# EAGLE schematic LD12 (EAGLE 6.6.0)
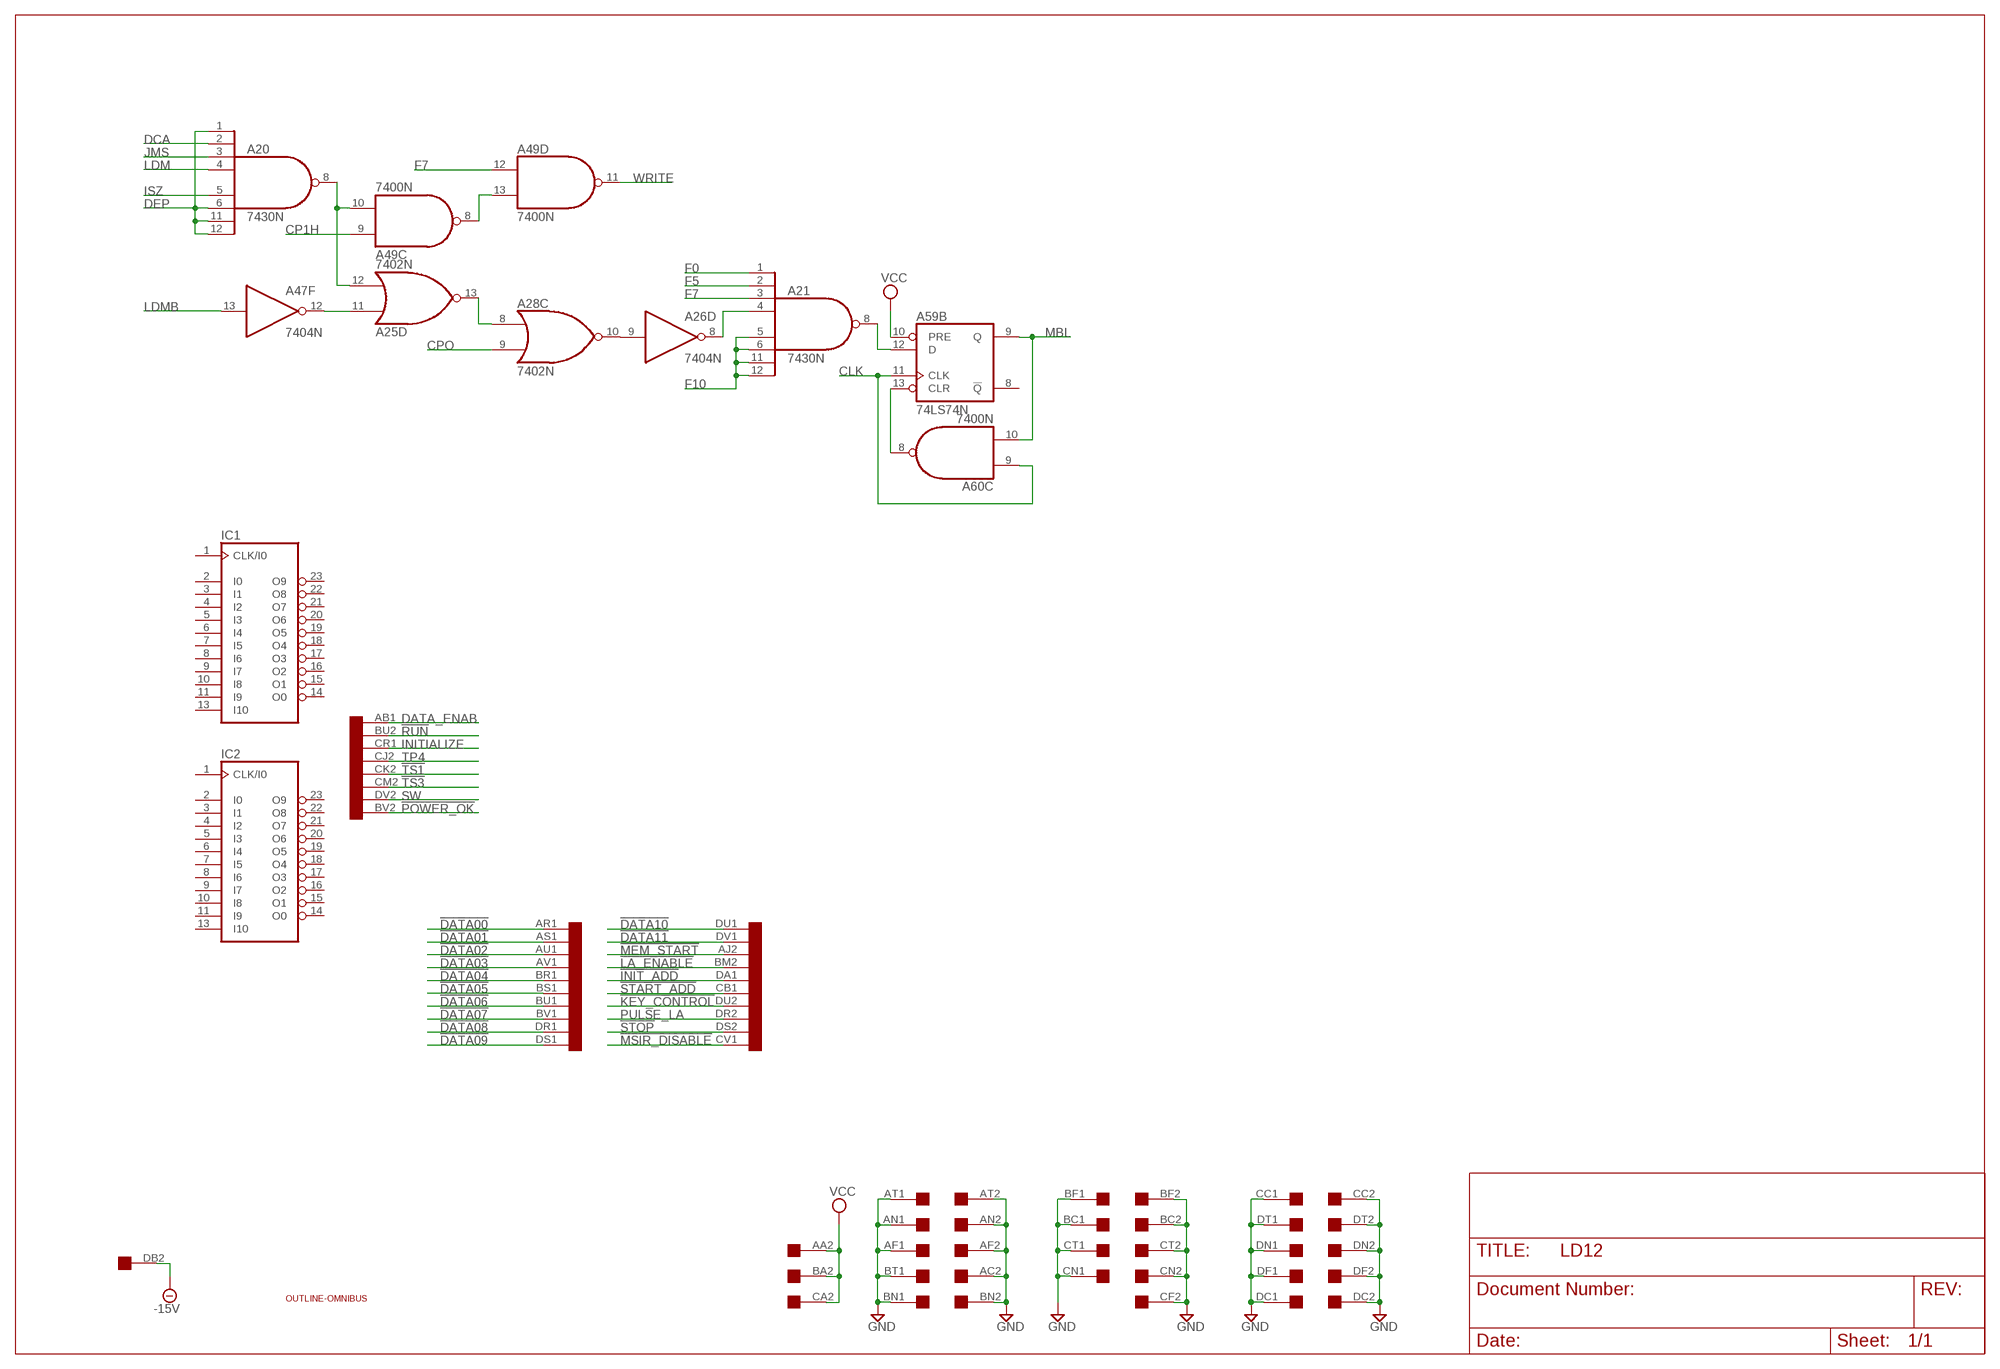
[diagram p0: schematic, sheet 1]

## Parts
A20  7430N  [DIL14]
A21  7430N  [DIL14]
A25  7402N  [DIL14]
A26  7404N  [DIL14]
A28  7402N  [DIL14]
A47  7404N  [DIL14]
A49  7400N  [DIL14]
A59  74LS74N  [DIL14]
A60  7400N  [DIL14]
IC1  22V10  [DIL24-3]
IC2  22V10  [DIL24-3]
U$1  OUTLINE-OMNIBUS  [OMNIBUS]
U$2  QUAD  [EDGE-CON8]

## Nets
!DATA00: U$2.AR1
!DATA01: U$2.AS1
!DATA02: U$2.AU1
!DATA03: U$2.AV1
!DATA04: U$2.BR1
!DATA05: U$2.BS1
!DATA06: U$2.BU1
!DATA07: U$2.BV1
!DATA08: U$2.DR1
!DATA09: U$2.DS1
!DATA10: U$2.DU1
!DATA11: U$2.DV1
!INIT_ADD: U$2.DA1
!KEY_CONTROL: U$2.DU2
!LA_ENABLE: U$2.BM2
!MEM_START: U$2.AJ2
!MSIR_DISABLE: U$2.CV1
!POWER_OK: U$2.BV2
!RUN: U$2.BU2
!START_ADD: U$2.CB1
!STOP: U$2.DS2
!TS1: U$2.CK2
!TS3: U$2.CM2
-15V [supply]: U$2.DB2
CLK: A59.11(B:CLK) A60.9(C:I0)
CP1H: A49.9(C:I0)
CPO: A28.9(C:I1)
DATA_ENAB: U$2.AB1
DCA: A20.2(I1)
DEP: A20.1(I0) A20.6(I5) A20.11(I6) A20.12(I7)
F0: A21.1(I0)
F5: A21.2(I1)
F7: A21.3(I2) A49.12(D:I0)
F10: A21.5(I4) A21.6(I5) A21.11(I6) A21.12(I7)
GND [supply]: U$2.AC2 U$2.AF1 U$2.AF2 U$2.AN1 U$2.AN2 U$2.AT1 U$2.AT2 U$2.BC1 U$2.BC2 U$2.BF1 U$2.BF2 U$2.BN1 U$2.BN2 U$2.BT1 U$2.CC1 U$2.CC2 U$2.CF2 U$2.CN1 U$2.CN2 U$2.CT1 U$2.CT2 U$2.DC1 U$2.DC2 U$2.DF1 U$2.DF2 U$2.DN1 U$2.DN2 U$2.DT1 U$2.DT2
INITIALIZE: U$2.CR1
ISZ: A20.5(I4)
JMS: A20.3(I2)
LDM: A20.4(I3)
LDMB: A47.13(F:I)
MBL: A59.9(B:Q) A60.10(C:I1)
N$1: A20.8(O) A25.12(D:I1) A49.10(C:I1)
N$2: A25.11(D:I0) A47.12(F:O)
N$3: A49.8(C:O) A49.13(D:I1)
N$4: A25.13(D:O) A28.8(C:I0)
N$5: A26.9(D:I) A28.10(C:O)
N$6: A21.4(I3) A26.8(D:O)
N$7: A21.8(O) A59.12(B:D)
N$8: A59.13(B:CLR) A60.8(C:O)
PULSE_LA: U$2.DR2
SW: U$2.DV2
TP4: U$2.CJ2
VCC: A59.10(B:PRE) U$2.AA2 U$2.BA2 U$2.CA2
WRITE: A49.11(D:O)
Unconnected: A25.1(A:O) A25.2(A:I0) A25.3(A:I1) A25.4(B:O) A25.5(B:I0) A25.6(B:I1) A25.8(C:I0) A25.9(C:I1) A25.10(C:O) A26.1(A:I) A26.2(A:O) A26.3(B:I) A26.4(B:O) A26.5(C:I) A26.6(C:O) A26.10(E:O) A26.11(E:I) A26.12(F:O) A26.13(F:I) A28.1(A:O) A28.2(A:I0) A28.3(A:I1) A28.4(B:O) A28.5(B:I0) A28.6(B:I1) A28.11(D:I0) A28.12(D:I1) A28.13(D:O) A47.1(A:I) A47.2(A:O) A47.3(B:I) A47.4(B:O) A47.5(C:I) A47.6(C:O) A47.8(D:O) A47.9(D:I) A47.10(E:O) A47.11(E:I) A49.1(A:I0) A49.2(A:I1) A49.3(A:O) A49.4(B:I0) A49.5(B:I1) A49.6(B:O) A59.1(A:CLR) A59.2(A:D) A59.3(A:CLK) A59.4(A:PRE) A59.5(A:Q) A59.6(A:!Q) A59.8(B:!Q) A60.1(A:I0) A60.2(A:I1) A60.3(A:O) A60.4(B:I0) A60.5(B:I1) A60.6(B:O) A60.11(D:O) A60.12(D:I0) A60.13(D:I1) IC1.1(CLK/I0) IC1.2(I0) IC1.3(I1) IC1.4(I2) IC1.5(I3) IC1.6(I4) IC1.7(I5) IC1.8(I6) IC1.9(I7) IC1.10(I8) IC1.11(I9) IC1.13(I10) IC1.14(O0) IC1.15(O1) IC1.16(O2) IC1.17(O3) IC1.18(O4) IC1.19(O5) IC1.20(O6) IC1.21(O7) IC1.22(O8) IC1.23(O9) IC2.1(CLK/I0) IC2.2(I0) IC2.3(I1) IC2.4(I2) IC2.5(I3) IC2.6(I4) IC2.7(I5) IC2.8(I6) IC2.9(I7) IC2.10(I8) IC2.11(I9) IC2.13(I10) IC2.14(O0) IC2.15(O1) IC2.16(O2) IC2.17(O3) IC2.18(O4) IC2.19(O5) IC2.20(O6) IC2.21(O7) IC2.22(O8) IC2.23(O9) U$2.AA1 U$2.AB2 U$2.AC1 U$2.AD1 U$2.AD2 U$2.AE1 U$2.AE2 U$2.AH1 U$2.AH2 U$2.AJ1 U$2.AK1 U$2.AK2 U$2.AL1 U$2.AL2 U$2.AM1 U$2.AM2 U$2.AP1 U$2.AP2 U$2.AR2 U$2.AS2 U$2.AU2 U$2.AV2 U$2.BA1 U$2.BB1 U$2.BB2 U$2.BD1 U$2.BD2 U$2.BE1 U$2.BE2 U$2.BH1 U$2.BH2 U$2.BJ1 U$2.BJ2 U$2.BK1 U$2.BK2 U$2.BL1 U$2.BL2 U$2.BM1 U$2.BP1 U$2.BP2 U$2.BR2 U$2.BS2 U$2.BT2 U$2.CA1 U$2.CB2 U$2.CD1 U$2.CD2 U$2.CE1 U$2.CE2 U$2.CF1 U$2.CH1 U$2.CH2 U$2.CJ1 U$2.CK1 U$2.CL1 U$2.CL2 U$2.CM1 U$2.CP1 U$2.CP2 U$2.CR2 U$2.CS1 U$2.CS2 U$2.CU1 U$2.CU2 U$2.CV2 U$2.DA2 U$2.DB1 U$2.DD1 U$2.DD2 U$2.DE1 U$2.DE2 U$2.DH1 U$2.DH2 U$2.DJ1 U$2.DJ2 U$2.DK1 U$2.DK2 U$2.DL1 U$2.DL2 U$2.DM1 U$2.DM2 U$2.DP1 U$2.DP2

## Power pins joined to a net without a drawn wire
GND: A20.7(GND) A21.7(GND) A25.7(P:GND) A26.7(P:GND) A28.7(P:GND) A47.7(P:GND) A49.7(P:GND) A59.7(P:GND) A60.7(P:GND) IC1.12(GND) IC2.12(GND)
VCC: A20.14(VCC) A21.14(VCC) A25.14(P:VCC) A26.14(P:VCC) A28.14(P:VCC) A47.14(P:VCC) A49.14(P:VCC) A59.14(P:VCC) A60.14(P:VCC) IC1.24(VCC) IC2.24(VCC)

## Library data of the parts
A20 A21 = 74xx-us:74*30: 8-input NAND gate
A25 A28 = 74xx-us:74*02: Quad 2-input NOR gate
A26 A47 = 74xx-us:74*04: Hex INVERTER
A49 A60 = 74xx-us:74*00: Quad 2-input NAND gate
A59 = 74xx-us:74*74: Dual D type positive edge triggered FLIP FLOP, preset and clear
IC1 IC2 = pal:22V10: PAL; MPN: GAL22V10D-7LPN; OC_FARNELL: 1571925; OC_NEWARK: 97M0480
U$1 = dec-con:OUTLINE-*: Board outlines for DEC boards.
U$2 = dec-con:QUAD: Quad-Height DEC board

## Net classes
1 supply: width 0.635 mm